# EasyEDA schematic AirRemoteEasyEda.json
TITLE: Air Remote; REV: 1.0; Date: 2024-11-23; Sheet: 1/1; Company: jugeekuz
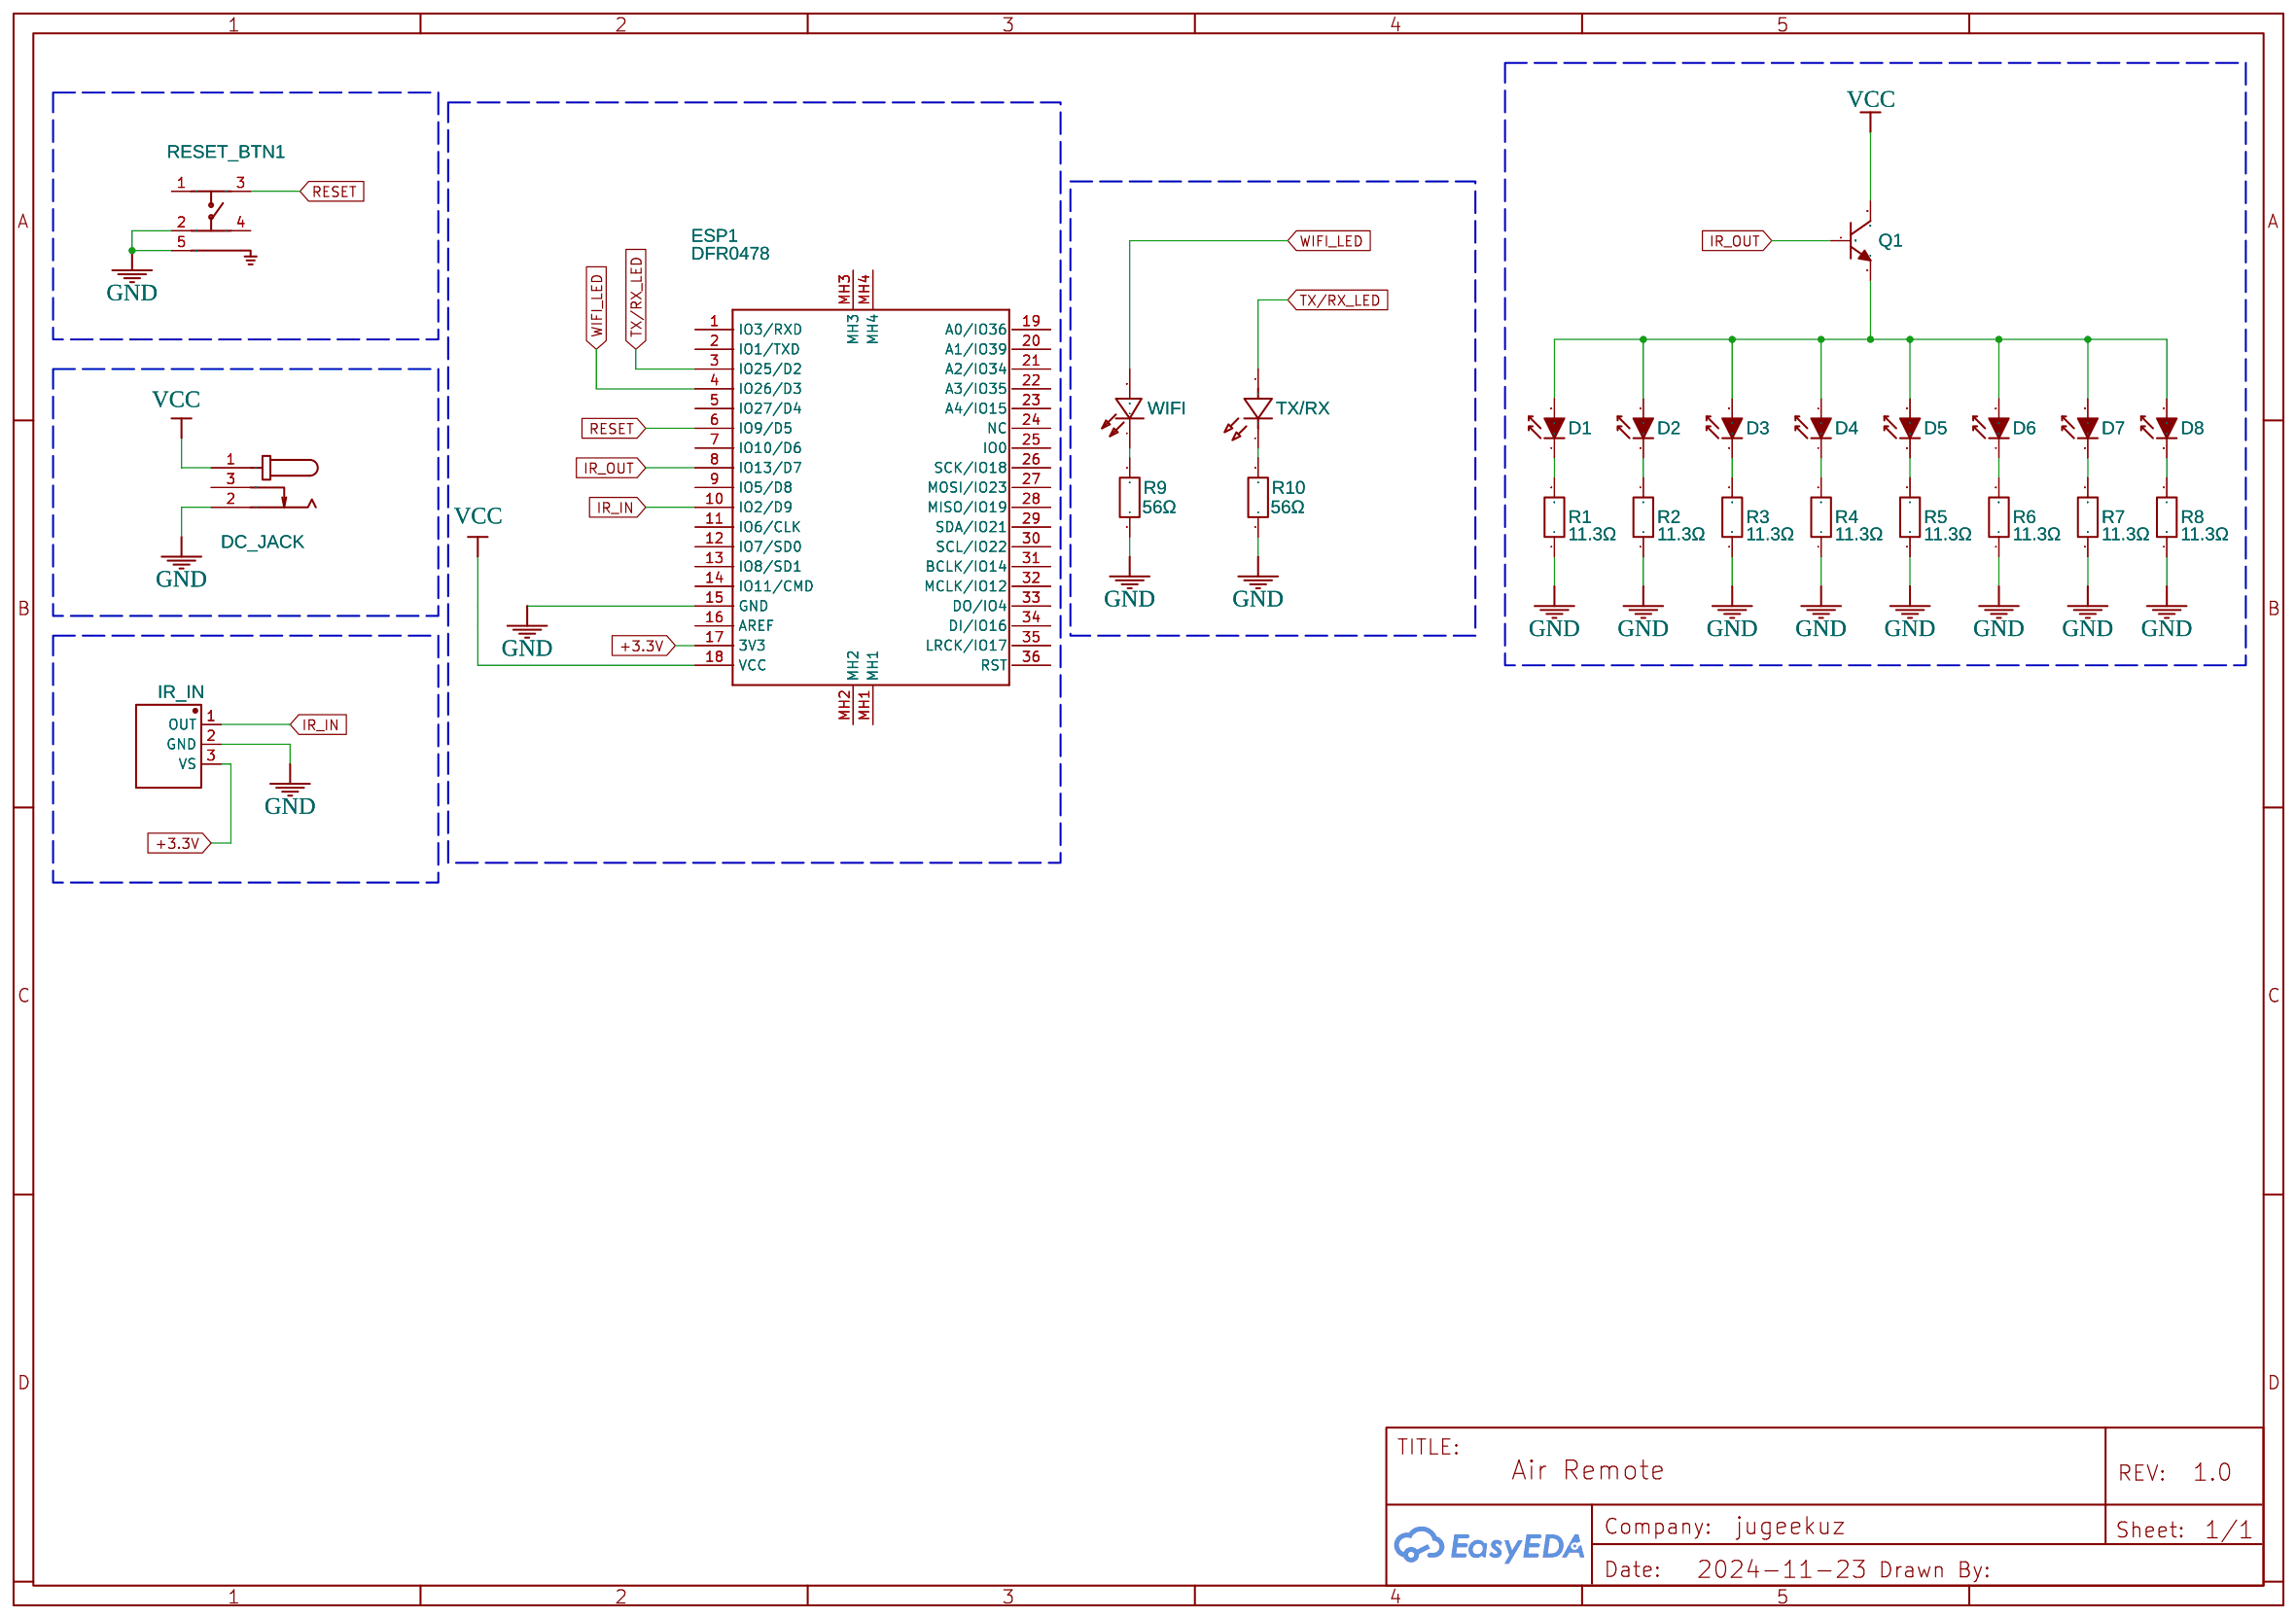
[diagram p0: schematic sheet]

## Parts
D1  SFH4546  [LED-5MM]
D2  SFH4546  [LED-5MM]
D3  SFH4546  [LED-5MM]
D4  SFH4546  [LED-5MM]
D5  SFH4546  [LED-5MM]
D6  SFH4546  [LED-5MM]
D7  SFH4546  [LED-5MM]
D8  SFH4546  [LED-5MM]
DC_JACK  DC_JACK  [DC-IN-TH_KLDX-0202-X-LT]
ESP1  DFR0478  [FIREBEETLE_ESP32]
LED1  IR_IN  [SENSOR-TG_TSOP38236]
Q1  PBSS4580PA,115  [SOT-1061_L2.0-W2.0-P1.30-BR]
R1  11.3Ω  [R2512]
R2  11.3Ω  [R2512]
R3  11.3Ω  [R2512]
R4  11.3Ω  [R2512]
R5  11.3Ω  [R2512]
R6  11.3Ω  [R2512]
R7  11.3Ω  [R2512]
R8  11.3Ω  [R2512]
R9  56Ω  [R0805]
R10  56Ω  [R0805]
RESET_BTN1  TS06-667-25-R-160-G-SMT-TR  [SW-SMD_5P-L6.0-W6.7-P4.50-LS8.4]
TX/RX  TX/RX  [LED0805-RD]
WIFI  WIFI  [LED-SMD_L2.0-W1.25-RD-GREEN]

## Library data of the parts
D1-D8 = SFH4546: Contributor: aru88np
DC_JACK = KLDX-0202-BP-LT: Supplier: LCSC; Supplier Part: C19842602; Manufacturer: Kycon; JLCPCB Part Class: Extended Part; Contributor: lcsc
ESP1 = DFR0478: Contributor: rikisaputro28
LED1 = TSOP38238: Contributor: LCSC; Supplier: LCSC; Manufacturer: VISHAY(威世); Supplier Part: C141632; JLCPCB Part Class: Extended Part
Q1 = PBSS4580PA,115: Contributor: LCSC; Supplier: LCSC; Supplier Part: C551945; Manufacturer: Nexperia(安世); JLCPCB Part Class: Extended Part
R1-R8 = FRC2512J130 TS: Contributor: lcsc; Supplier: LCSC; Supplier Part: C2934088; Manufacturer: FOJAN(富捷); JLCPCB Part Class: Extended Part
R9 R10 = TNPW080582R0DETA: Supplier: LCSC; Supplier Part: C4276441; Manufacturer: VISHAY(威世); Contributor: lcsc; JLCPCB Part Class: Extended Part
RESET_BTN1 = TS06-667-25-R-160-G-SMT-TR: Contributor: lcsc; Supplier: LCSC; Supplier Part: C4364540; Manufacturer: CUI
TX/RX = HSMD-C170: Supplier: LCSC; Supplier Part: C6795833; Manufacturer: Broadcom/AVAGO(安华高); JLCPCB Part Class: Extended Part; Contributor: lcsc
WIFI = HSMG-C170: Contributor: LCSC; Supplier: LCSC; Supplier Part: C188728; Manufacturer: Broadcom/AVAGO(安华高); JLCPCB Part Class: Extended Part

## Nets
+3.3V: ESP1.17(3V3) LED1.3(VS)
GND: DC_JACK.2 ESP1.15(GND) LED1.2(GND) R1.1 R2.1 R3.1 R4.1 R5.1 R6.1 R7.1 R8.1 R9.1 R10.1 RESET_BTN1.2 RESET_BTN1.5
VCC: DC_JACK.1 ESP1.18(VCC) Q1.3(C)
IR_IN: ESP1.10(IO2/D9) LED1.1(OUT)
IR_OUT: ESP1.8(IO13/D7) Q1.1(B)
RESET: ESP1.6(IO9/D5) RESET_BTN1.3
TX/RX_LED: ESP1.3(IO25/D2) TX/RX.2(A)
WIFI_LED: ESP1.4(IO26/D3) WIFI.2
Net-(D1-1): D1.1(K) R1.2
Net-(D1-2): D1.2(A) D2.2(A) D3.2(A) D4.2(A) D5.2(A) D6.2(A) D7.2(A) D8.2(A) Q1.2(E)
Net-(D2-1): D2.1(K) R2.2
Net-(D3-1): D3.1(K) R3.2
Net-(D4-1): D4.1(K) R4.2
Net-(D5-1): D5.1(K) R5.2
Net-(D6-1): D6.1(K) R6.2
Net-(D7-1): D7.1(K) R7.2
Net-(D8-1): D8.1(K) R8.2
Net-(R9-2): R9.2 WIFI.1
Net-(R10-2): R10.2 TX/RX.1(K)

Not connected (* = marked no-connect by the designer): DC_JACK 3; ESP1 1(IO3/RXD) 2(IO1/TXD) 5(IO27/D4) 7(IO10/D6) 9(IO5/D8) 11(IO6/CLK) 12(IO7/SD0) 13(IO8/SD1) 14(IO11/CMD) 16(AREF) 19(A0/IO36) 20(A1/IO39) 21(A2/IO34) 22(A3/IO35) 23(A4/IO15) 24(NC) 25(IO0) 26(SCK/IO18) 27(MOSI/IO23) 28(MISO/IO19) 29(SDA/IO21) 30(SCL/IO22) 31(BCLK/IO14) 32(MCLK/IO12) 33(DO/IO4) 34(DI/IO16) 35(LRCK/IO17) 36(RST) MH1 MH2 MH3 MH4; RESET_BTN1 1 4
